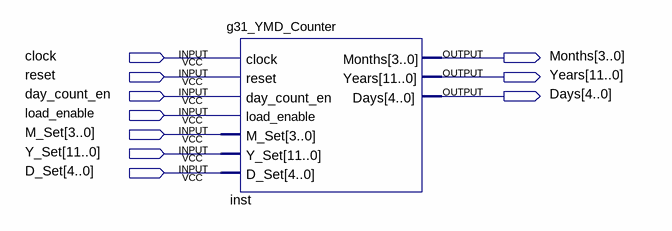
[diagram p0: schematic sheet]
// Quartus schematic g31_YMD_counter_circuit.bdf as structural Verilog: 1 symbols, 10 pins
module g31_YMD_counter_circuit (
  input  clock,
  input  reset,
  input  day_count_en,
  input  load_enable,
  input  [3:0] M_Set,
  input  [11:0] Y_Set,
  input  [4:0] D_Set,
  output [3:0] Months,
  output [11:0] Years,
  output [4:0] Days
);

  g31_YMD_Counter inst (
    .clock(clock), .reset(reset), .day_count_en(day_count_en), .load_enable(load_enable), .M_Set(M_Set),
    .Y_Set(Y_Set), .D_Set(D_Set), .Months(Months), .Years(Years), .Days(Days));
endmodule
